# Altium project Test_TG21.PrjPCB
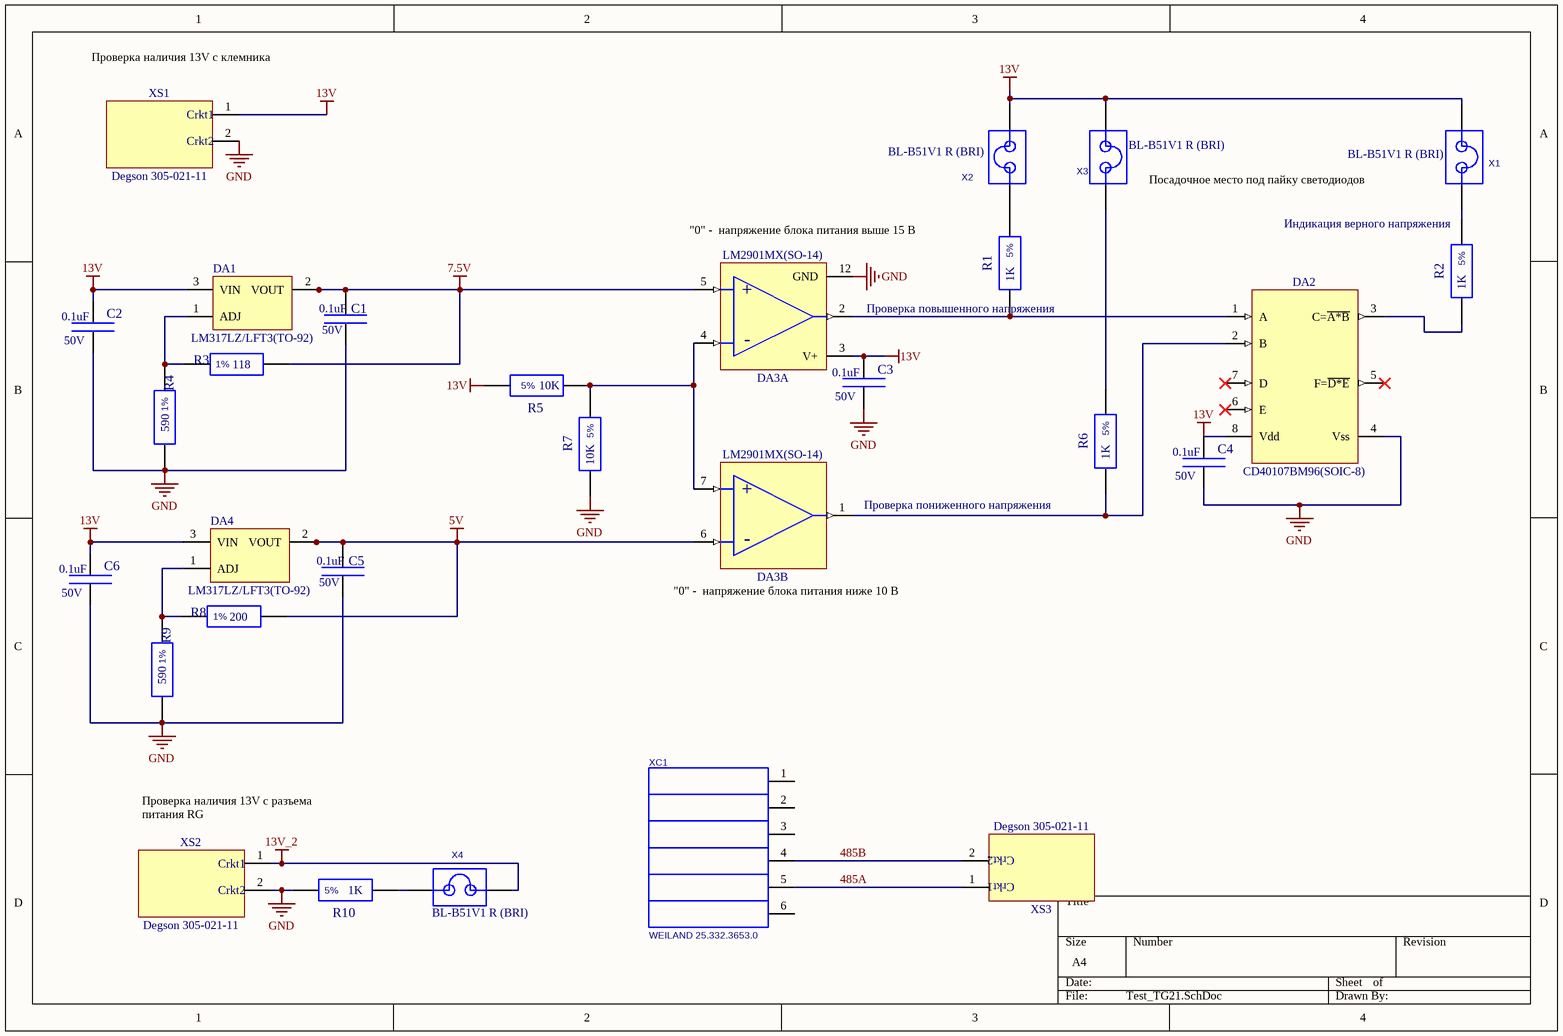
[diagram p0: Test_TG21.SchDoc]
1 sheet, 28 parts. Net scope: global (net labels, ports and power ports of the same name join across sheets).
Board file: Test_TG21.PcbDoc

## Sheet Test_TG21.SchDoc
size A4

### Parts
C1  value 0.1uF  parVoltage: 50V  [CAPC1608X50(0603)]  (hidden comment: чип 0603 0.1uF/50V,)
C2  value 0.1uF  parVoltage: 50V  [CAPC1608X50(0603)]  (hidden comment: чип 0603 0.1uF/50V,)
C3  value 0.1uF  parVoltage: 50V  [CAPC1608X50(0603)]  (hidden comment: чип 0603 0.1uF/50V,)
C4  value 0.1uF  parVoltage: 50V  [CAPC1608X50(0603)]  (hidden comment: чип 0603 0.1uF/50V,)
C5  value 0.1uF  parVoltage: 50V  [CAPC1608X50(0603)]  (hidden comment: чип 0603 0.1uF/50V,)
C6  value 0.1uF  parVoltage: 50V  [CAPC1608X50(0603)]  (hidden comment: чип 0603 0.1uF/50V,)
DA1  LM317LZ/LFT3(TO-92)  [SOT230P700X180-4N(SOT223)_NUM]
DA2  CD40107BM96(SOIC-8)  [SOIC127P600-8N]
DA3  LM2901MX(SO-14)  [SOIC127P600X145-14M]  (parts A,B of 4)
DA4  LM317LZ/LFT3(TO-92)  [SOT230P700X180-4N(SOT223)_NUM]
R1  value 1K  Tolerance: 5%  [RESC1608X45(0603)]  (hidden comment: чип 0603 1K 5%)
R2  value 1K  Tolerance: 5%  [RESC1608X45(0603)]  (hidden comment: чип 0603 1K 5%)
R3  value 118  Tolerance: 1%  [RESC1608X45(0603)]  (hidden comment: чип 0603 118 1%)
R4  value 590  Tolerance: 1%  [RESC1608X45(0603)]  (hidden comment: чип 0603 590 1%)
R5  value 10K  Tolerance: 5%  [RESC1608X45(0603)]  (hidden comment: чип 0603 10K 5%)
R6  value 1K  Tolerance: 5%  [RESC1608X45(0603)]  (hidden comment: чип 0603 1K 5%)
R7  value 10K  Tolerance: 5%  [RESC1608X45(0603)]  (hidden comment: чип 0603 10K 5%)
R8  value 200  Tolerance: 1%  [RESC1608X45(0603)]  (hidden comment: чип 0603 200 1%)
R9  value 590  Tolerance: 1%  [RESC1608X45(0603)]  (hidden comment: чип 0603 590 1%)
R10  value 1K  Tolerance: 5%  [RESC1608X45(0603)]  (hidden comment: чип 0603 1K 5%)
X1  value BL-B51V1 R (BRI)  [JMP]  (hidden comment: JMP)
X2  value BL-B51V1 R (BRI)  [JMP]  (hidden comment: JMP)
X3  value BL-B51V1 R (BRI)  [JMP]  (hidden comment: JMP)
X4  value BL-B51V1 R (BRI)  [JMP]  (hidden comment: JMP)
XC1  WEILAND 25.332.3653.0  [WEILAND_25.332.3653.0]
XS1  Degson 305-021-11  [305-021-11]
XS2  Degson 305-021-11  [305-021-11]
XS3  Degson 305-021-11  [305-021-11]

### Nets
5V: C5.2(P2) DA3.6(IN-) DA4.2(VOUT) DA4.4(VOUT) R8.1
7.5V: C1.2(P2) DA1.2(VOUT) DA1.4(VOUT) DA3.5(IN+) R3.1
13V: C2.2(P2) C3.2(P2) C4.2(P2) C6.2(P2) DA1.3(VIN) DA2.8(Vdd) DA3.3(V+) DA4.3(VIN) R5.2 X1.1 X2.2 X3.1 XS1.1
13V_2: X4.2 XS2.1
GND: C1.1(P1) C2.1(P1) C3.1(P1) C4.1(P1) C5.1(P1) C6.1(P1) DA2.4(Vss) DA3.12(GND) R4.1 R7.1 R9.1 R10.2 XS1.2 XS2.2
485A: XC1.5 XS3.1
485B: XC1.4 XS3.2
NetDA1_1: DA1.1(ADJ) R3.2 R4.2
NetDA2_1: DA2.1(A) DA3.2(Out) R1.1
NetDA2_2: DA2.2(B) DA3.1(Out) R6.1
NetDA2_3: DA2.3(C=~{A*B}) R2.1
NetDA3_4: DA3.4(IN-) DA3.7(IN+) R5.1 R7.2
NetDA4_1: DA4.1(ADJ) R8.2 R9.2
NetR1_2: R1.2 X2.1
NetR2_2: R2.2 X1.2
NetR6_2: R6.2 X3.2
NetR10_1: R10.1 X4.1

Not connected (* = marked no-connect by the designer): DA2 5(F=~{D*E})* 6(E)* 7(D)*; XC1 1 2 3 6

### Notes on the sheet
- (near XS1) Проверка наличия 13V с клемника
- (near DA3) "0" -  напряжение блока питания выше 15 В
- (near X3) Посадочное место под пайку светодиодов
- (near R2) Индикация верного напряжения
- (near R1) Проверка повышенного напряжения
- (near DA3) Проверка пониженного напряжения
- (near DA3) "0" -  напряжение блока питания ниже 10 В
- (near XS2) Проверка наличия 13V c разъема питания RG
- (in symbol 305-021-11) Crkt1; Crkt2
- (in symbol LM2901, part A) +; -
- (in symbol LM2901, part B) +; -

### Library data of the parts
C1-C6 = C0603: cmpDescription: чип 0603 0.1uF , 50V, ,; Category: Конденсатор; cmpPkg: чип 0603
DA1 DA4 = Lm317l-n: 3-Terminal Adjustable Regulator; cmpManufacturer: TI; cmpDescription: TI LM317LZ/LFT3 (TO-92), -40°C to 125°C; parOTemp: -40°C to 125°C; cmpPartNum: LM317LZ/LFT3; cmpPkg: TO-92; Category: Микросхема
DA2 = CD40107B: CMOS Dual 2-Input NAND Buffer/Driver; cmpManufacturer: TI; parOTemp: -55°C to 125°C; cmpDescription: TI CD40107BM96 (SOIC-8), -55°C to 125°C; Value: *; Category: Микросхема; Примечание: *; cmpPartNum: CD40107BM96; cmpPkg: SOIC-8
DA3 = LM2901: cmpManufacturer: TI; parOTemp: -40°C to 85°C; cmpDescription: TI LM2901MX (SO-14), -40°C to 85°C; Category: Микросхема; cmpPartNum: LM2901MX; cmpPkg: SO-14
R1 R2 R6 R10 = R0603: cmpDescription: чип 0603 1K 5%, 100 мВт, ,; parPwr: 100 мВт; Category: Резистор; cmpPkg: чип 0603
R3 = R0603: cmpDescription: чип 0603 118 1%, 100 мВт, ,; parPwr: 100 мВт; Category: Резистор; cmpPkg: чип 0603
R4 R9 = R0603: cmpDescription: чип 0603 590 1%, 100 мВт, ,; parPwr: 100 мВт; Category: Резистор; cmpPkg: чип 0603
R5 R7 = R0603: cmpDescription: чип 0603 10K 5%, 100 мВт, ,; parPwr: 100 мВт; Category: Резистор; cmpPkg: чип 0603
R8 = R0603: cmpDescription: чип 0603 200 1%, 100 мВт, ,; parPwr: 100 мВт; Category: Резистор; cmpPkg: чип 0603
XC1 = WEILAND_6PIN_5MM: cmpCategory: Industrial; cmpDescription: pitch, pins,; Value: *; Category: Разъем; cmpPartNum: WEILAND 25.332.3653.0
XS1-XS3 = 305-021-11: Клеммник винтовой, 2-контактный, 5мм, прямой; parType: Straight; cmpCategory: Industrial; cmpDescription: Degson Клеммник винтовой 5mm pitch,2 pins, Straight; cmpPinCount: 2; cmpPitch: 5mm; Category: Разъем; cmpPartNum: 305-021-11; cmpManufacturer: Degson; cmpType: Клеммник винтовой